# EAGLE schematic main (EAGLE 6.5.0)
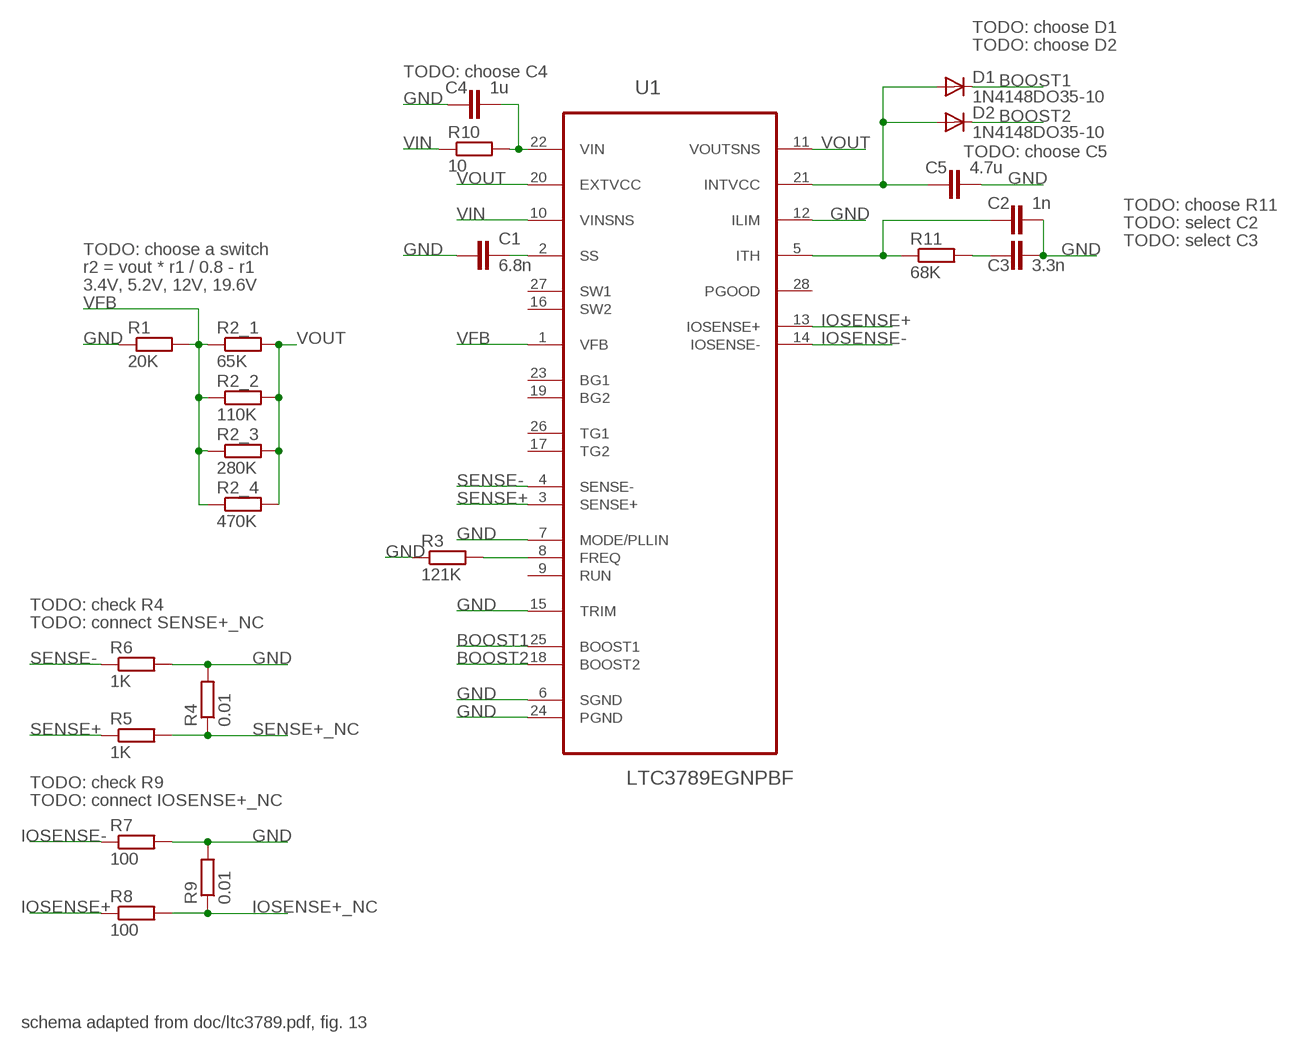
[diagram p0: schematic, sheet 1]

## Parts
C1  6.8n  C-EUC1206K  [C1206K]
C2  1n  C-EUC1206K  [C1206K]
C3  3.3n  C-EUC1206K  [C1206K]
C4  1u  C-EUC1206K  [C1206K]
C5  4.7u  C-EUC1206K  [C1206K]
D1  1N4148DO35-10  [DO35-10]
D2  1N4148DO35-10  [DO35-10]
R1  20K  R-EU_R1206  [R1206]
R2_1  65K  R-EU_R1206  [R1206]
R2_2  110K  R-EU_R1206  [R1206]
R2_3  280K  R-EU_R1206  [R1206]
R2_4  470K  R-EU_R1206  [R1206]
R3  121K  R-EU_R1206  [R1206]
R4  0.01  R-EU_R1206  [R1206]
R5  1K  R-EU_R1206  [R1206]
R6  1K  R-EU_R1206  [R1206]
R7  100  R-EU_R1206  [R1206]
R8  100  R-EU_R1206  [R1206]
R9  0.01  R-EU_R1206  [R1206]
R10  10  R-EU_R1206  [R1206]
R11  68K  R-EU_R1206  [R1206]
U1  LTC3789EGNPBF  [SOP65P640X120-28N]

## Nets
BOOST1: D1.C U1.25(BOOST1)
BOOST2: D2.C U1.18(BOOST2)
GND: C1.1 C2.2 C3.2 C4.1 C5.2 R1.1 R3.1 R4.2 R6.2 R7.2 R9.2 U1.6(SGND) U1.7(MODE/PLLIN) U1.12(ILIM) U1.15(TRIM) U1.24(PGND)
IOSENSE+: R8.1 U1.13(IOSENSE+)
IOSENSE+_NC: R8.2 R9.1
IOSENSE-: R7.1 U1.14(IOSENSE-)
N$1: R3.2 U1.8(FREQ)
N$2: C4.2 R10.2 U1.22(VIN)
N$3: C1.2 U1.2(SS)
N$4: C2.1 R11.1 U1.5(ITH)
N$5: C3.1 R11.2
N$6: C5.1 D1.A D2.A U1.21(INTVCC)
SENSE+: R5.1 U1.3(SENSE+)
SENSE+_NC: R4.1 R5.2
SENSE-: R6.1 U1.4(SENSE-)
VFB: R1.2 R2_1.1 R2_2.1 R2_3.1 R2_4.1 U1.1(VFB)
VIN: R10.1 U1.10(VINSNS)
VOUT: R2_1.2 R2_2.2 R2_3.2 R2_4.2 U1.11(VOUTSNS) U1.20(EXTVCC)
Unconnected: U1.9(RUN) U1.16(SW2) U1.17(TG2) U1.19(BG2) U1.23(BG1) U1.26(TG1) U1.27(SW1) U1.28(PGOOD)

## Notes on the sheet
- TODO: choose D1
- TODO: choose D2
- TODO: choose C4
- TODO: choose C5
- TODO: choose R11
- TODO: select C2
- TODO: select C3
- TODO: choose a switch
- r2 = vout * r1 / 0.8 - r1
- 3.4V, 5.2V, 12V, 19.6V
- TODO: check R4
- TODO: connect SENSE+_NC
- TODO: check R9
- TODO: connect IOSENSE+_NC
- schema adapted from doc/ltc3789.pdf, fig. 13

## Library data of the parts
C1-C5 = rcl:C-EU: CAPACITOR, European symbol
D1 D2 = diode:1N4148: DIODE high speed (Philips)
R1 R2_1-R2_4 R3-R11 = resistor:R-EU_: RESISTOR, European symbol
U1 = LTC-LTC3789EGN#PBF:LTC3789EGNPBF: High Efficiency, Synchronous, 4-Switch Buck-Boost Controller; MPN: LTC3789EGN#PBF; OC_FARNELL: 2102662; OC_NEWARK: 24T0452; PACKAGE: TSSOP-28; SUPPLIER: LINEAR TECHNOLOGY